# EAGLE design rfid_module_v4 (EAGLE 8.0.1)

## Sheet 1 of 2: RFID Module V4
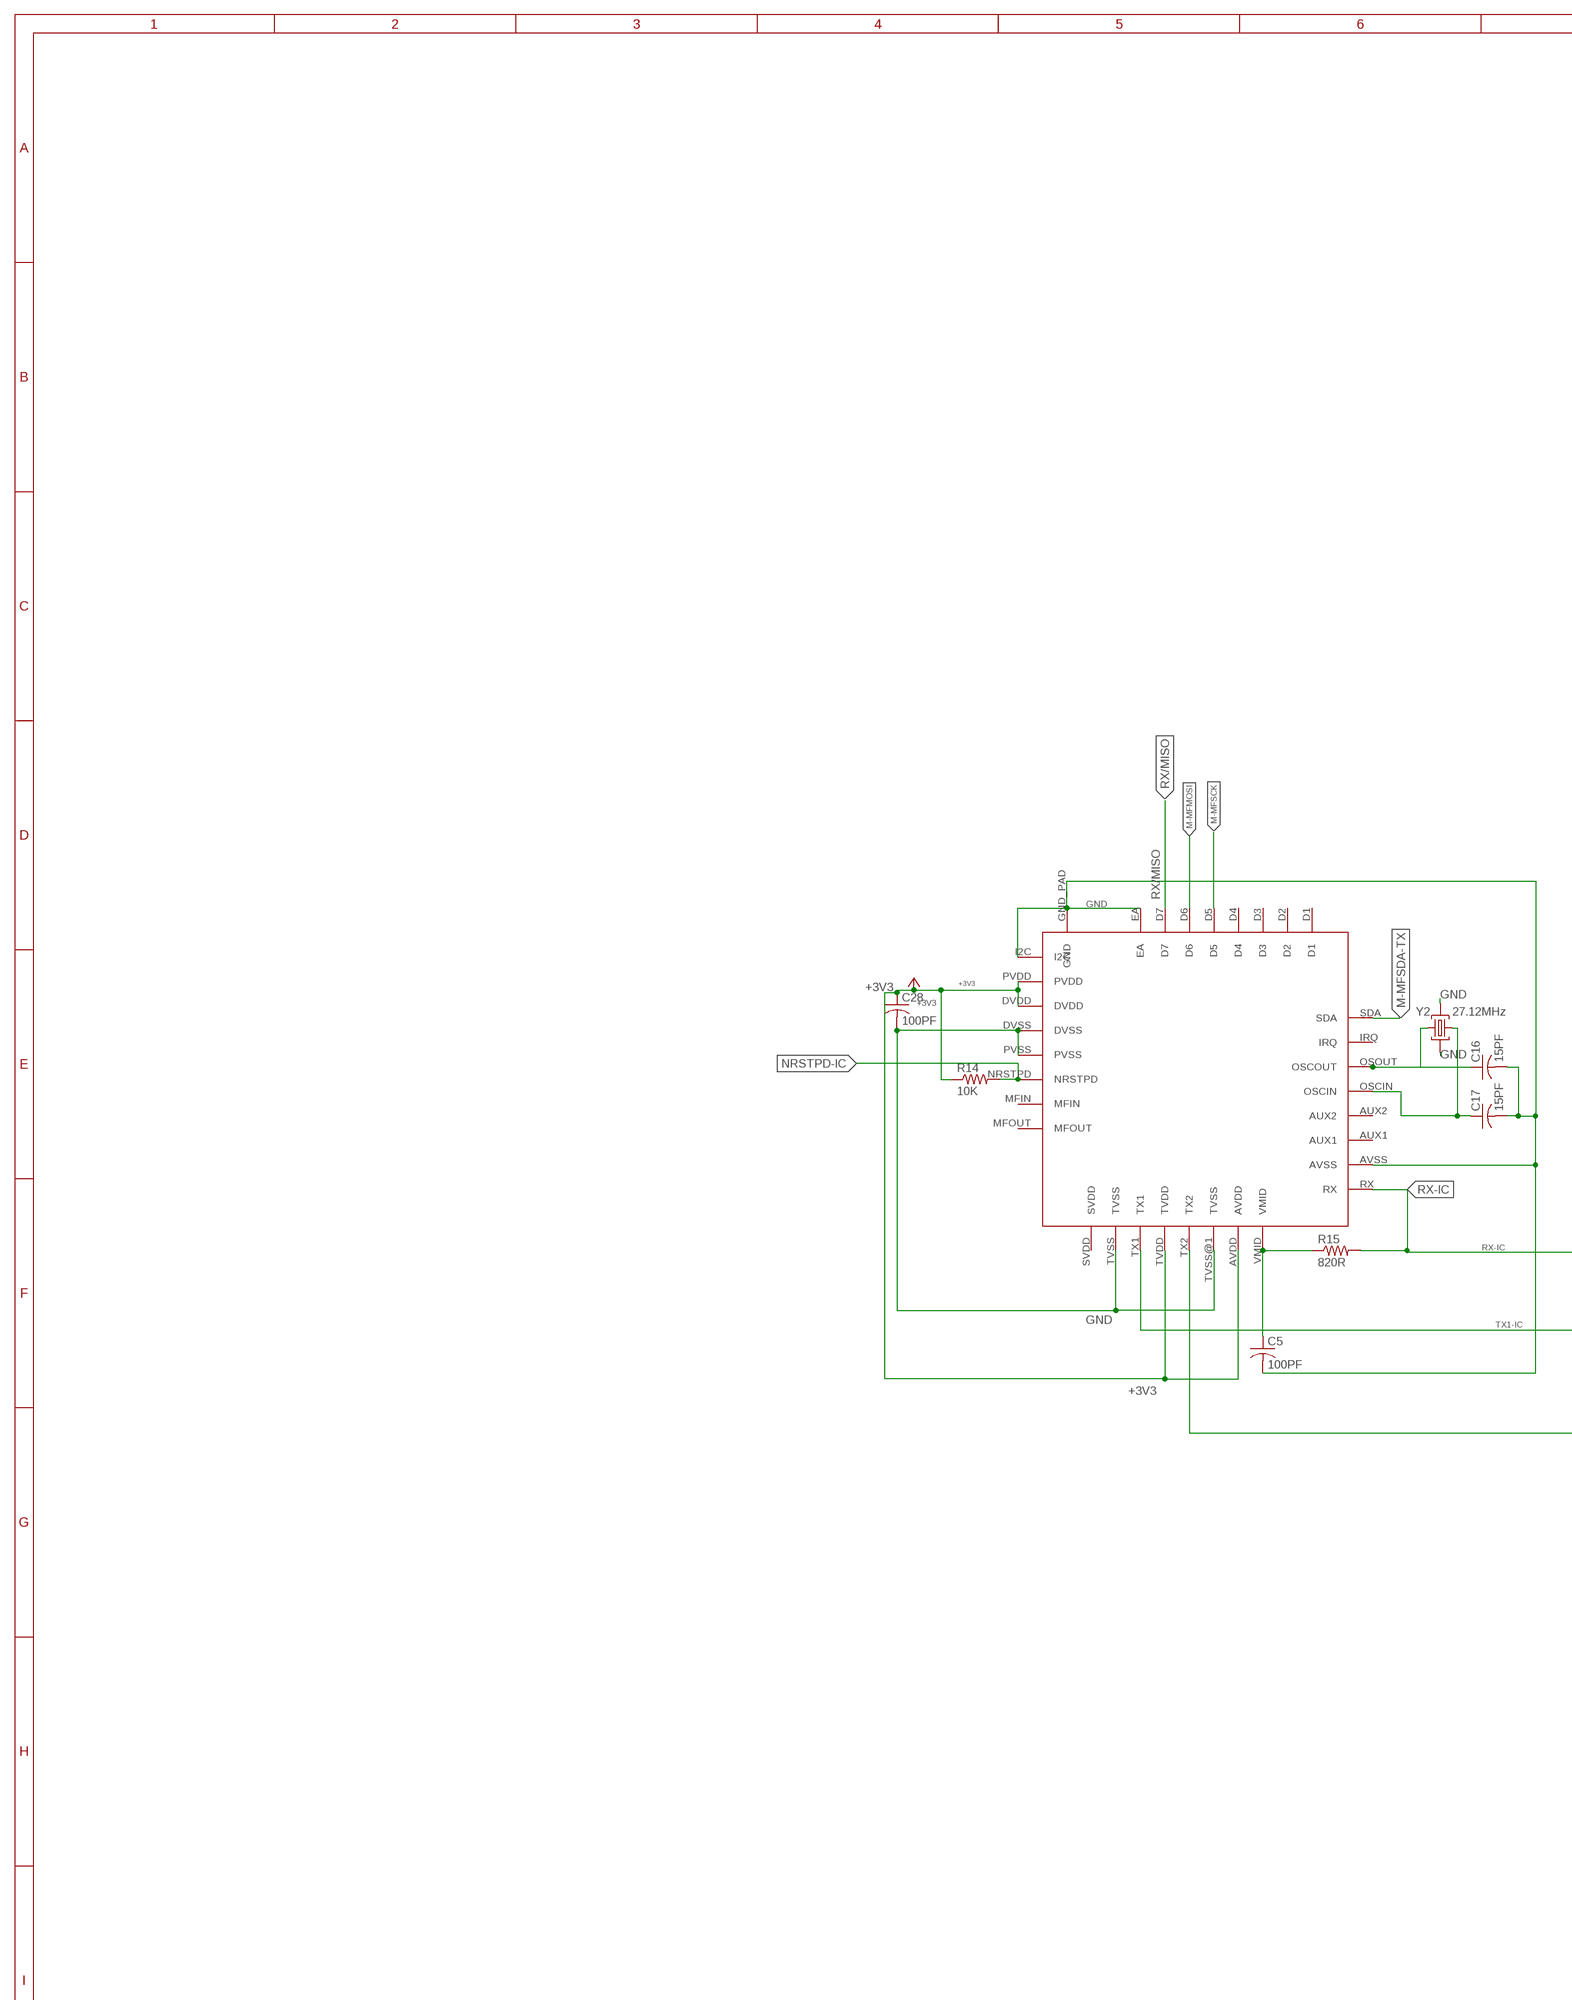
[diagram p0: schematic, sheet 1, part 1 of 2]
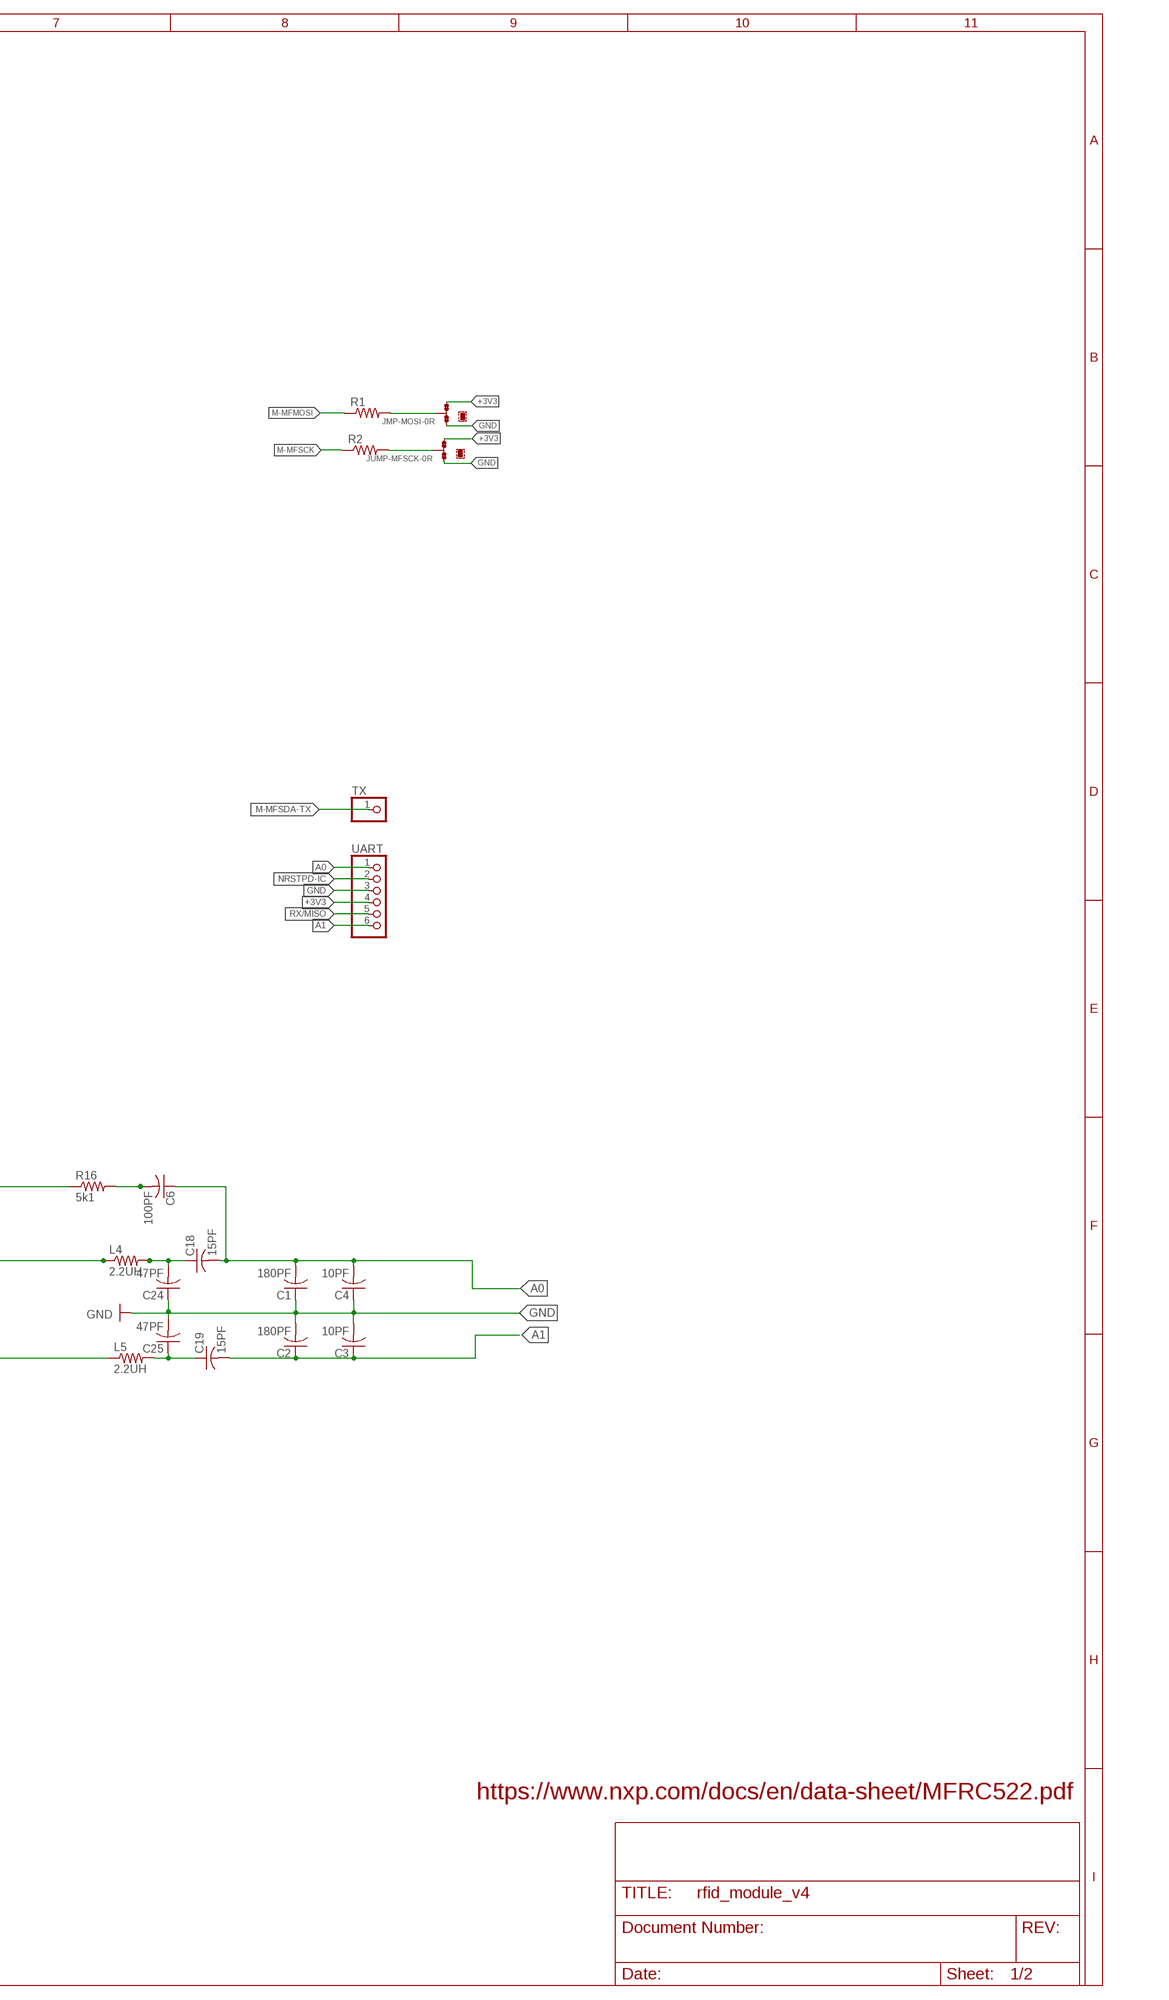
[diagram p1: schematic, sheet 1, part 2 of 2]

### Parts
C1  180PF  C-USC0603  [C0603]
C2  180PF  C-USC0603  [C0603]
C3  10PF  C-USC0603  [C0603]
C4  10PF  C-USC0603  [C0603]
C5  100PF  C-USC0603  [C0603]
C6  100PF  C-USC0603  [C0603]
C16  15PF  C-USC0603  [C0603]
C17  15PF  C-USC0603  [C0603]
C18  15PF  C-USC0603  [C0603]
C19  15PF  C-USC0603  [C0603]
C24  47PF  C-USC0603  [C0603]
C25  47PF  C-USC0603  [C0603]
C28  100PF  C-USC0603  [C0603]
JMP-MOSI  0R-JUMPA  [A0R-JMP]
JUMP-MFSCK  0R-JUMPA  [A0R-JMP]
L4  2.2UH  R-US_R0603  [R0603]
L5  2.2UH  R-US_R0603  [R0603]
R1  R-US_R0603  [R0603]
R2  R-US_R0603  [R0603]
R14  10K  R-US_R0603  [R0603]
R15  820R  R-US_R0603  [R0603]
R16  5k1  R-US_R0603  [R0603]
TX  PINHD-1X1  [1X01]
U$1  MFRC522  [MFRC522]
UART  PINHD-1X6  [1X06]
Y2  27.12MHz  CRYSTAL-3.2-2.5  [CRYSTAL-3.2-2.5]

### Nets
+3V3: C28.1 JMP-MOSI.3 JUMP-MFSCK.3 R14.1 U$1.AVDD U$1.DVDD U$1.PVDD U$1.TVDD UART.4 ; supply symbol labelled +3.3V
A0: C1.2 C4.2 C6.1 C18.2 UART.1
A1: C2.1 C3.1 C19.2 UART.6
GND: C1.1 C2.2 C3.2 C4.1 C5.2 C16.2 C17.2 C24.1 C25.2 C28.2 JMP-MOSI.1 JUMP-MFSCK.1 U$1.AVSS U$1.DVSS U$1.EA U$1.GND_PAD(GND) U$1.I2C U$1.PVSS U$1.TVSS U$1.TVSS@1(TVSS) UART.3 Y2.2(GND) Y2.4(GND)
M-MFMOSI: R1.1 U$1.D6
M-MFSCK: R2.1 U$1.D5
M-MFSDA-TX: TX.1 U$1.SDA
N$2: C18.1 C24.2 L4.2
N$4: JMP-MOSI.2 R1.2
N$6: C19.1 C25.1 L5.2
N$9: JUMP-MFSCK.2 R2.2
N$10: C6.2 R16.2
NRSTPD-IC: R14.2 U$1.NRSTPD UART.2
OSCIN-IC: C17.1 U$1.OSCIN Y2.1(C1)
OSOUT-IC: C16.1 U$1.OSOUT(OSCOUT) Y2.3(C2)
RX-IC: R15.2 R16.1 U$1.RX
RX/MISO: U$1.D7 UART.5
TX1-IC: L4.1 U$1.TX1
TX2-IC: L5.1 U$1.TX2
VMID-IC: C5.1 R15.1 U$1.VMID
Unconnected: U$1.AUX1 U$1.AUX2 U$1.D1 U$1.D2 U$1.D3 U$1.D4 U$1.IRQ U$1.MFIN U$1.MFOUT U$1.SVDD

### Notes on the sheet
- https://www.nxp.com/docs/en/data-sheet/MFRC522.pdf

## Sheet 2 of 2: Notes
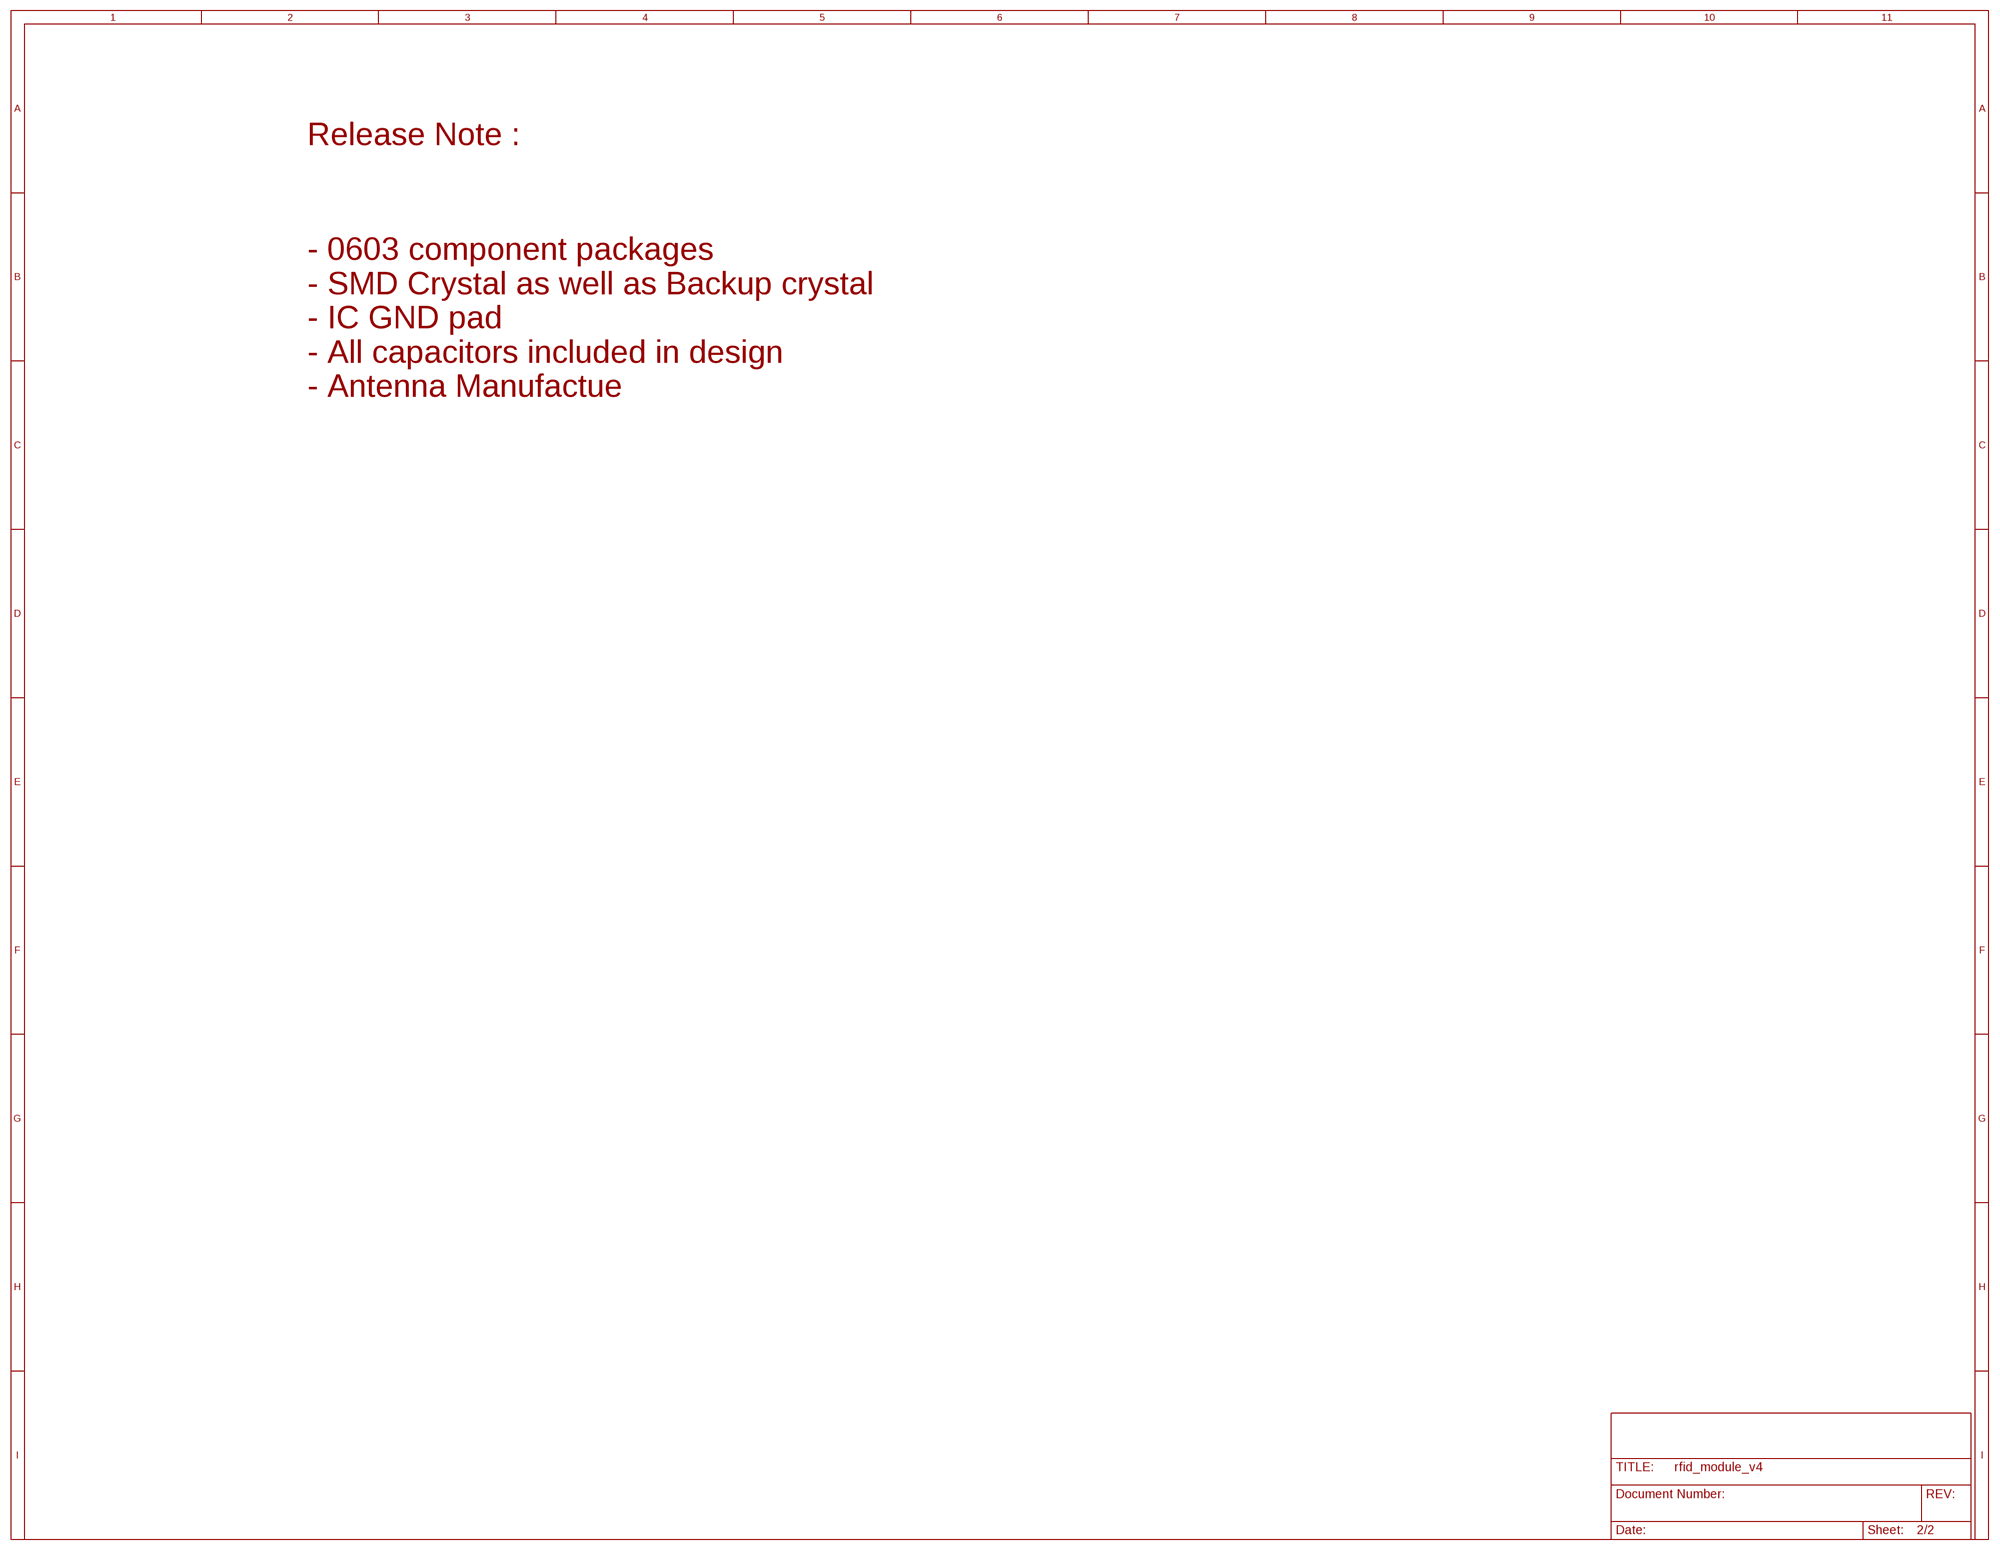
[diagram p2: schematic, sheet 2]

### Notes on the sheet
- Release Note :
- - 0603 component packages
  - SMD Crystal as well as Backup crystal
  - IC GND pad
  - All capacitors included in design
  - Antenna Manufactue

## Library data of the parts
C1-C6 C16-C19 C24 C25 C28 = rcl:C-US: CAPACITOR, American symbol
JMP-MOSI JUMP-MFSCK = jump-0r-smd:0R-JUMP: SMD 0R 0805 Jumper
L4 L5 R1 R2 R14-R16 = rcl:R-US_: RESISTOR, American symbol
TX = pinhead:PINHD-1X1: PIN HEADER
U$1 = mfrc522:MFRC522
UART = pinhead:PINHD-1X6: PIN HEADER
Y2 = SmartPrj:CRYSTAL-3.2-2.5

## Net classes
0 default: width 0.254 mm, drill 0.229 mm, clearance 0.203 mm

## Board
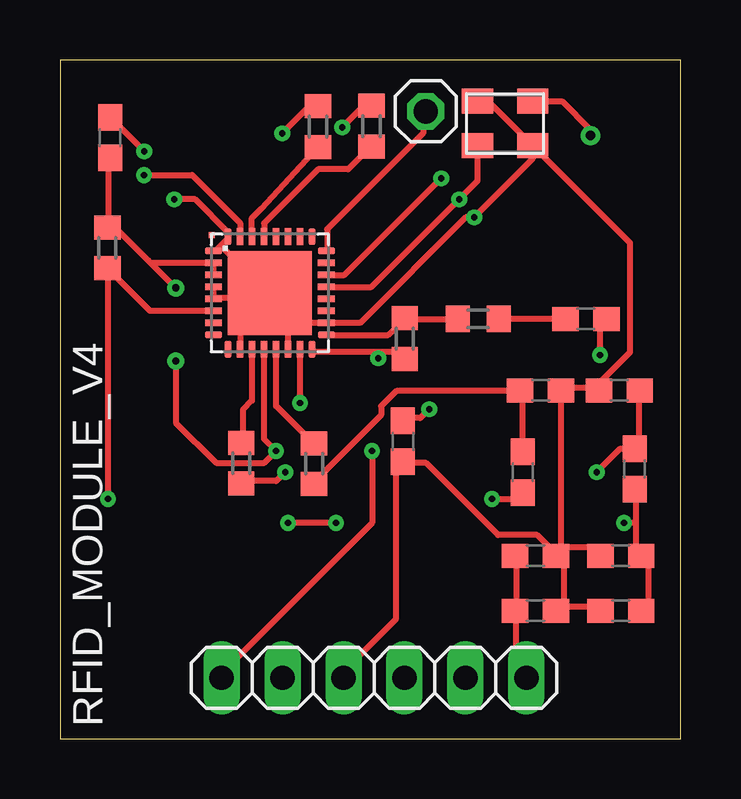
[diagram p3: board, top side]
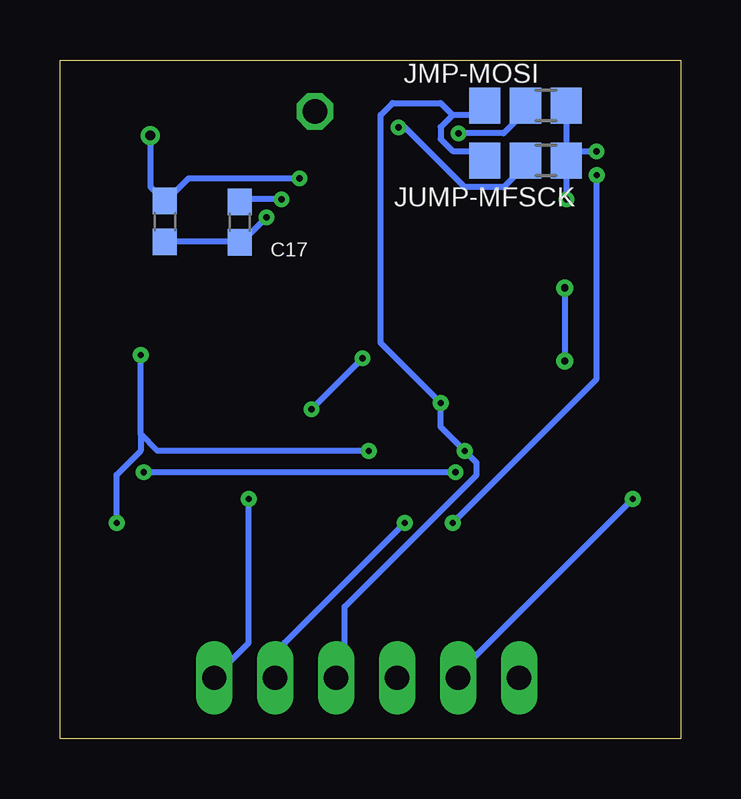
[diagram p4: board, bottom side, seen from below]

Size 25.86 x 28.3 mm. Coordinates in mm from the lower left corner, seen from the top.
Outline: 0,0 25.86,0 25.86,28.3 0,28.3 0,0
Copper layers (1*16): Top 0.035mm / dielectric 1.5mm / Bottom 0.035mm
Design rules "default *": minimum track width 10mil, minimum drill 10mil, track to track 8mil, track to pad 8mil, pad to pad 8mil, via to via 8mil, smd to smd 8mil, copper to edge 40mil, drill to drill 8mil, minimum pad ring 10mil, minimum via ring 8mil, stop-mask expansion 4mil, vias tented up to drill 0mil, thermal gap 10mil

### Footprints (pad centres in the part's own frame; a part is rotated, then mirrored left to right if it is on the bottom)
C0603 = smd 1.1 x 1: 1 -0.85,0; 2 0.85,0
A0R-JMP = smd 1.5 x 1.3: 1 0,1.7; 2 0,0; 3 0,-1.7
R0603 = smd 1 x 1.1: 1 -0.85,0; 2 0.85,0
1X01 = drill 1.016 octagon: 1 0,0
MFRC522 = smd 0.7 x 0.28: AUX1 2.35,-0.75; AUX2 2.35,-0.25; AVSS 2.35,-1.25; DVDD -2.35,0.75; DVSS -2.35,0.25; I2C -2.35,1.75; IRQ 2.35,1.25; MFIN -2.35,-1.25; MFOUT -2.35,-1.75; NRSTPD -2.35,-0.75; OSCIN 2.35,0.25; OSOUT 2.35,0.75; PVDD -2.35,1.25; PVSS -2.35,-0.25; RX 2.35,-1.75; SDA 2.35,1.75 | smd 0.28 x 0.7: AVDD 1.25,-2.35; D1 1.75,2.35; D2 1.25,2.35; D3 0.75,2.35; D4 0.25,2.35; D5 -0.25,2.35; D6 -0.75,2.35; D7 -1.25,2.35; EA -1.75,2.35; SVDD -1.75,-2.35; TVDD -0.25,-2.35; TVSS -1.25,-2.35; TVSS@1 0.75,-2.35; TX1 -0.75,-2.35; TX2 0.25,-2.35; VMID 1.75,-2.35 | smd 3.5 x 3.5: GND_PAD 0,0 | smd 0.25 x 0.25: M1 -2.415,2.415
1X06 = drill 1.016 long: 1 -6.35,0; 2 -3.81,0; 3 -1.27,0; 4 1.27,0; 5 3.81,0; 6 6.35,0
CRYSTAL-3.2-2.5 = smd 1.3 x 1.05: 1 -1.15,-0.925; 2 1.15,-0.925; 3 1.15,0.925; 4 -1.15,0.925

### Placement (x,y rotation side)
C1  23.37,7.62 0 top
C2  19.81,7.62 0 top
C3  19.81,5.33 0 top
C4  23.37,5.33 0 top
C5  14.29,12.4 270 top
C6  21.91,17.51 180 top
C16  21.5,21.57 270 bottom
C17  18.38,21.54 270 bottom
C18  23.94,11.25 270 top
C19  19.27,11.11 270 top
C24  23.31,14.53 0 top
C25  20.02,14.53 0 top
C28  2.08,25.06 90 top
JMP-MOSI  6.46,26.39 270 bottom
JUMP-MFSCK  6.46,24.11 270 bottom
L4  7.55,11.49 270 top
L5  10.59,11.47 270 top
R1  10.75,25.52 90 top
R2  12.98,25.54 90 top
R14  1.98,20.47 270 top
R15  14.37,16.68 90 top
R16  17.42,17.51 0 top
TX  15.24,26.16 0 top
U$1  8.75,18.59 0 top
UART  13.08,2.54 0 top
Y2  18.54,25.65 0 top

### Tracks (layer width: path | path; a pad name or v marks a point on that pad's centre or on a via)
+3V3  (via drill 0.25, 0.3)
  Top 0.254: R14.1 2,21.36 2,24.11 C28.1 | 6.38,19.36 U$1.DVDD U$1.PVDD 3.78,19.84 3.68,19.94 | 2.13,21.36 R14.1 | 2.25,21.36 R14.1 | 8.5,16 U$1.TVDD 8.5,12.5 v9,12 8.5,11.5 6.5,11.5 4.83,13.17 v4.83,15.75 | v10,14 10,16 U$1.AVDD | R14.1 2.3,21.32 3.68,19.94 | 3.68,19.94 v4.82,18.8 v4.83,18.8
  Bottom 0.254: 9.5,26 10,25.5 10,25 9.5,24.5 8.5,24.5 JUMP-MFSCK.3 | 9.5,26 8.5,26 JMP-MOSI.3 | UART.4 14,3 14,5.5 8.5,11 8.5,11.5 v9,12 10,13 v10,14 12.5,16.5 12.5,26 12,26.5 10,26.5 9.5,26 | v4.83,18.8 v4.83,15.75
A0  (via drill 0.25)
  Top 0.254: C4.2 24.5,5.5 24.5,7.5 C1.2 24,8 24,9 | 24,9 24,10 C18.2 | v22.5,16 22.5,17.5 C6.1 | 24,9 v23.5,9 | v13,12 13,9 7,3 UART.1
  Bottom 0.254: 22.5,12.7 22.5,12 23.5,11 v23.5,9 | 22.5,12.7 v22.5,16 | v13,12 21.8,12 22.5,12.7
A1  (via drill 0.25)
  Top 0.254: C2.1 19,7.5 19,5.5 C3.1 19,5 19,3 UART.6 | v18,10 19,10 C19.2
  Bottom 0.254: v18,10 18,4 19,3 UART.6
GND  (via drill 0.25)
  Top 0.254: v3.5,24.49 2.13,25.86 C28.2 | 6.69,20.55 7,20.86 U$1.EA 7,21.12 5.63,22.49 v4.75,22.49 | 6.69,20.55 6.5,20.36 U$1.I2C | U$1.DVSS 6.38,18.74 6.38,18.36 U$1.PVSS 6.5,18.36 8.38,18.36 U$1.GND_PAD | U$1.TVSS 7.5,17.36 8.63,18.49 U$1.GND_PAD | U$1.TVSS@1 9.5,17.34 | 8.25,17.99 U$1.GND_PAD | 8.94,17.68 9,17.36 | 8.94,17.68 U$1.GND_PAD | 6.69,20.55 8.63,18.61 U$1.GND_PAD | 19.63,24.61 Y2.2 | C2.2 20.63,7.74 19.88,8.49 18.25,8.49 15.25,11.49 14.38,11.49 C5.2 14,11.5 14,5 12,3 UART.3 | C2.2 20.88,7.74 20.88,14.49 C25.2 20.88,14.61 22.38,14.61 C24.1 22.38,14.74 23.75,16.11 23.75,20.67 Y2.2 | Y2.4 17.84,26.58 Y2.2 | C1.1 22.5,8 21,8 C2.2 | 21,5.5 22.5,5.5 C4.1 | 21,5.5 21,7.5 C2.2 | 21,5.5 C3.2 | 9.5,17.34 9.28,17.34 8.94,17.68 | 9.5,17.34 U$1.AVSS 12.51,17.34 16.91,21.74 v17.25,21.74 19.69,24.18 Y2.2
  Bottom 0.254: v3.5,24.49 4.38,24.49 JUMP-MFSCK.1 | JMP-MOSI.1 4.75,26.36 4.75,24.24 JUMP-MFSCK.1 | C16.2 21.38,20.74 18.38,20.74 C17.2 18.25,20.74 v17.25,21.74 | v4.75,22.49 4.75,23.99 JUMP-MFSCK.1
M-MFMOSI
  Top 0.254: 8,20.99 U$1.D6 8,21.71 8.38,22.1 R1.1 10.63,24.61
M-MFSCK
  Top 0.254: U$1.D5 8.5,20.99 8.5,21.49 10.75,23.74 12,23.74 12.88,24.61 R2.1
M-MFSDA-TX
  Top 0.254: U$1.SDA 11.13,20.36 11.13,21.24 15.13,25.24 15.13,26.11 TX.1
N$2  (via drill 0.25)
  Top 0.254: v9.38,11.11 9,10.74 7.63,10.74 L4.2 | C18.1 23.88,12.11 | C24.2 24.13,14.49 24.13,12.49 23.88,12.24 C18.1 | v22.37,11.11 23.35,12.1 C18.1
  Bottom 0.254: v22.37,11.11 v9.38,11.11
N$4  (via drill 0.25)
  Top 0.254: v9.25,25.24 10.38,26.36 10.63,26.36 R1.2
  Bottom 0.254: v9.25,25.24 7.38,25.24 6.5,26.11 6.5,26.36 JMP-MOSI.2
N$6
  Top 0.254: C19.1 19.25,11.99 19.25,14.49 C25.1 19.13,14.49 14,14.49 13.38,13.86 13.38,13.49 10.63,10.74 L5.2
N$9  (via drill 0.25)
  Top 0.254: v11.75,25.49 12.63,26.36 12.88,26.36 R2.2
  Bottom 0.254: v11.75,25.49 11.5,25.49 9,22.99 7.38,22.99 6.38,23.99 JUMP-MFSCK.2
N$10
  Top 0.254: R16.2 18.38,17.49 21,17.49 C6.2
NRSTPD-IC  (via drill 0.25)
  Top 0.254: v2,10 2,19.5 R14.2 3.76,17.84 U$1.NRSTPD
  Bottom 0.254: v2,10 9,3 UART.2
OSCIN-IC  (via drill 0.25)
  Top 0.254: 17.38,24.61 Y2.1 17.39,23.25 v16.63,22.49 12.98,18.84 U$1.OSCIN
  Bottom 0.254: v16.63,22.49 18.25,22.49 C17.1
OSOUT-IC  (via drill 0.25, 0.4)
  Top 0.254: Y2.3 20.92,26.58 22.1,25.4 v22.1,25.15 | U$1.OSOUT 11.85,19.34 v15.88,23.36
  Bottom 0.254: v15.88,23.36 20.5,23.36 21.38,22.49 C16.1 22.1,23.02 v22.1,25.15
RX-IC
  Top 0.254: R16.1 16.5,17.49 14.38,17.49 R15.2 13.67,16.84 U$1.RX
RX/MISO  (via drill 0.25)
  Top 0.254: 7.5,20.99 U$1.D7 7.5,21 7.5,21.5 5.5,23.5 v3.5,23.5 | v11.5,9 v9.5,9
  Bottom 0.254: v3.5,23.5 3.5,15 v9.5,9 | v11.5,9 16.5,4 16.5,3 UART.5
TX1-IC
  Top 0.254: 8,16.11 U$1.TX1 8,14.09 7.62,13.72 7.62,12.41 L4.1 7.63,12.36
TX2-IC
  Top 0.254: U$1.TX2 9,16.11 9,13.86 10.5,12.36 L5.1
VMID-IC  (via drill 0.25)
  Top 0.254: 13.25,16.11 14,16.11 14.25,15.86 R15.1 | 13.25,16.11 10.5,16.11 U$1.VMID | v15.38,13.74 15,13.36 14.38,13.36 C5.1 | v13.25,15.86 13.25,16.11
  Bottom 0.254: v13.25,15.86 v15.38,13.74

### Text on the board
tNames: RFID_MODULE_V4
tValues: _ | + | _ | + | RST | Rx
bValues: _ | +